# EAGLE design fonte3 (EAGLE 9.6.2)
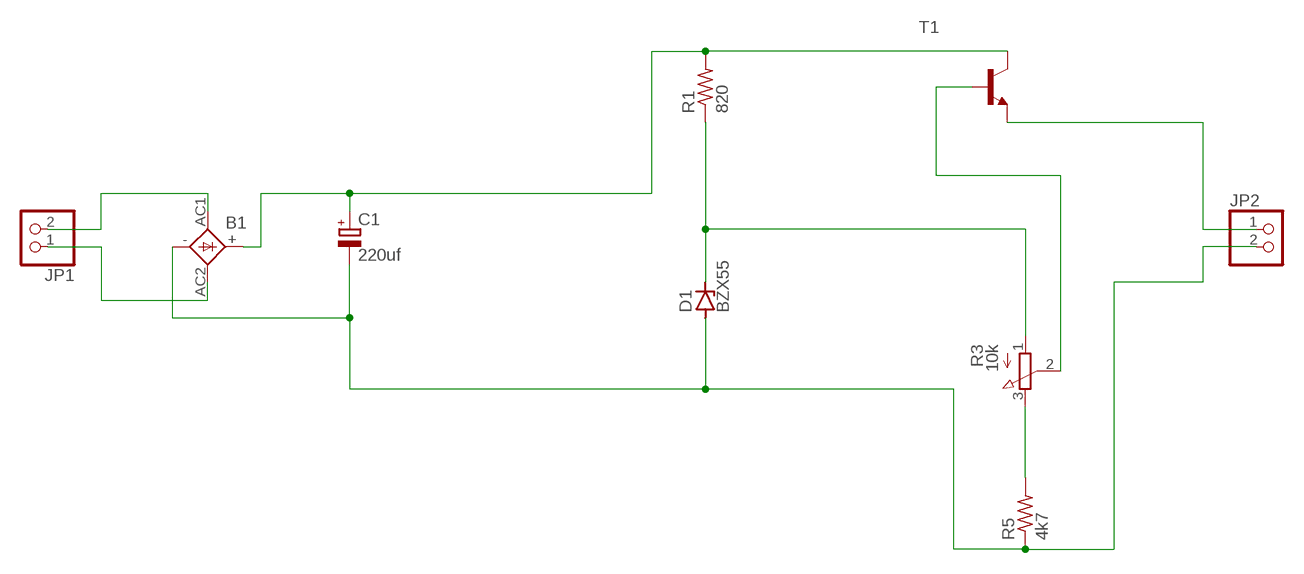
[diagram p0: schematic, sheet 1]

## Parts
B1  1KAB  [1KAB]
C1  220uf  CPOL-EUE5-10.5  [E5-10,5]
D1  BZX55  [DO35Z10]
JP1  PINHD-1X2  [1X02]
JP2  PINHD-1X2  [1X02]
R1  820  R-US_0309/12  [0309/12]
R3  10k  3RP/1610N  [3RP/1610N]
R5  4k7  R-US_0309/12  [0309/12]
T1  -NPN-TO5  [TO5]

## Nets
N$1: B1.AC1 JP1.2
N$2: B1.AC2 JP1.1
N$3: B1.+ C1.+ R1.2 T1.3(C)
N$4: R3.3(E) R5.2
N$5: B1.- C1.- D1.A JP2.2 R5.1
N$6: JP2.1 T1.1(E)
N$7: R3.2(S) T1.2(B)
N$9: D1.C R1.1 R3.1(A)

## Library data of the parts
B1 = rectifier:1KAB: RECTIFIER grid 5,08 x 5,08 mm
C1 = resistor:CPOL-EU: POLARIZED CAPACITOR, European symbol
D1 = diode:BZX55: Z DIODE
JP1 JP2 = pinhead:PINHD-1X2: PIN HEADER
R1 R5 = rcl:R-US_: RESISTOR, American symbol; SPICEPREFIX: R
R3 = pot:3RP/1610N: 16mm Potentiometer one level Source: http://www.alphapotentiometers.net/html/16mm_pot_2.html
T1 = transistor:*-NPN-: NPN Transistror BF959 corrected 2008.03.06

## Board
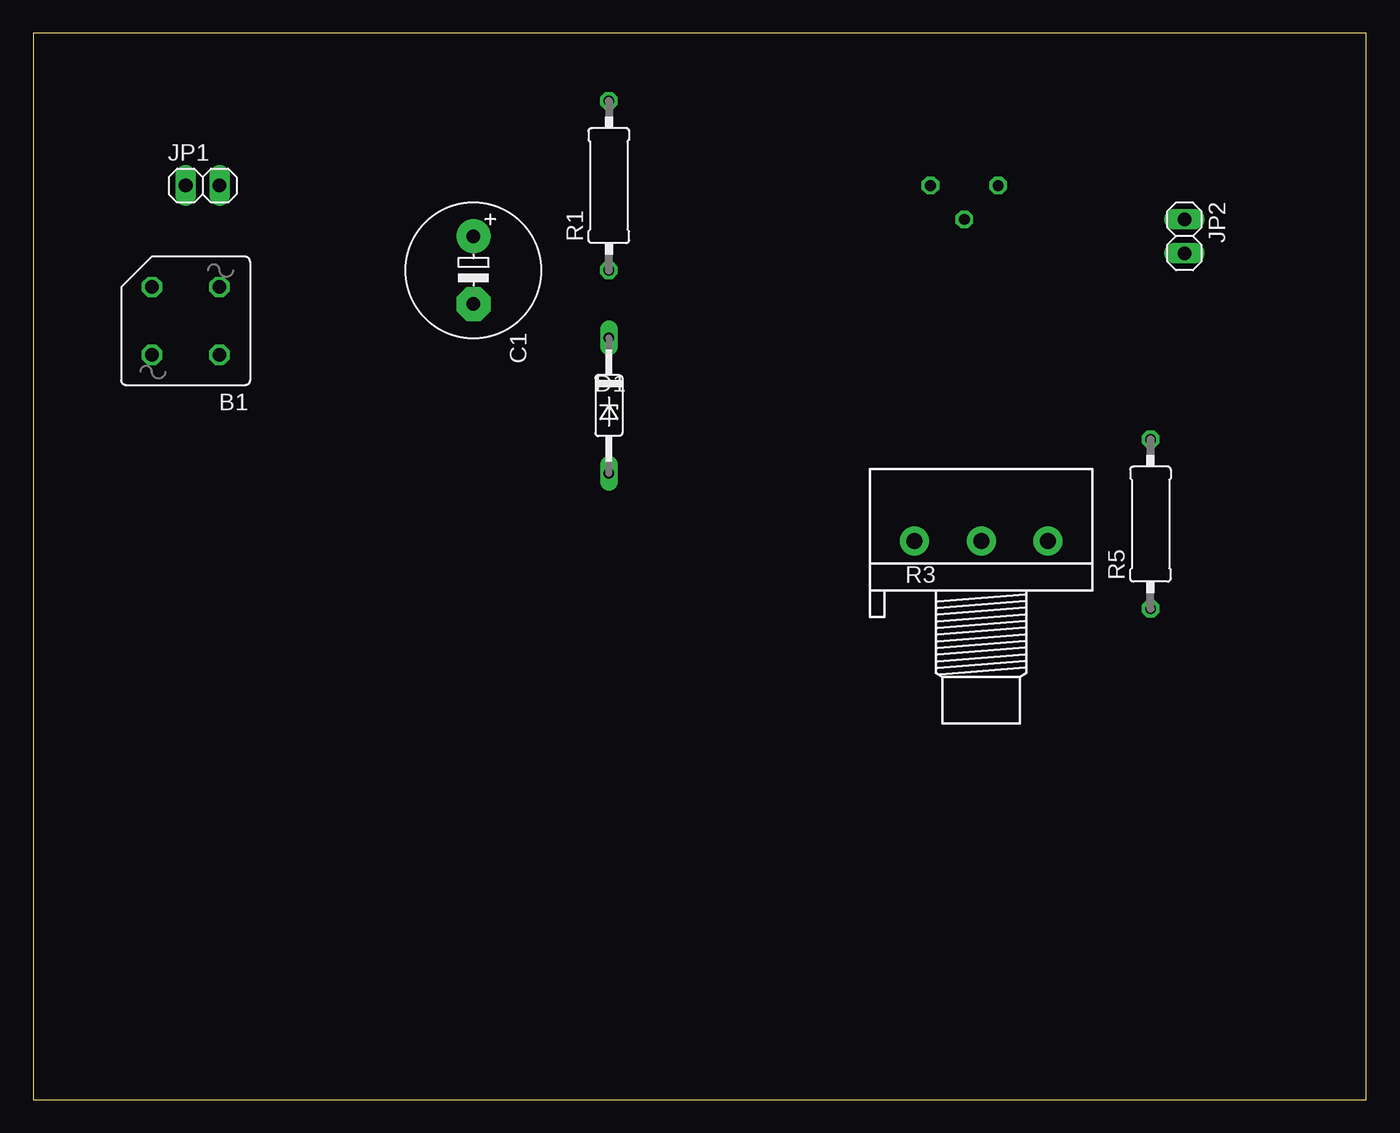
[diagram p1: board, top side]
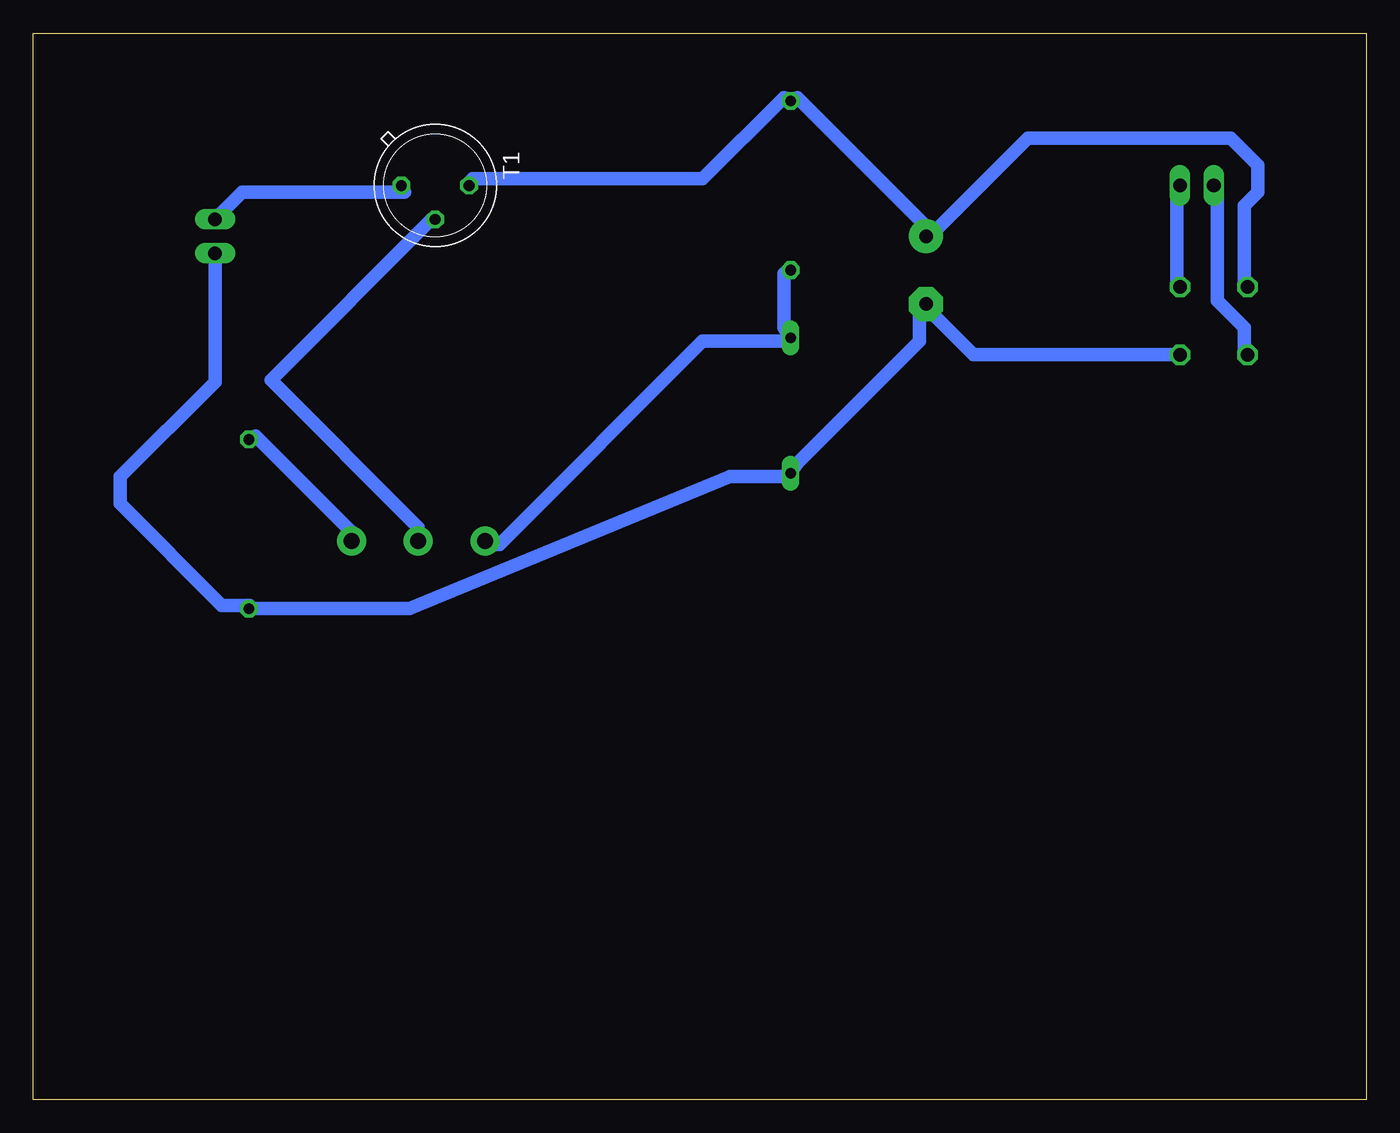
[diagram p2: board, bottom side, seen from below]

Size 100 x 80 mm. Coordinates in mm from the lower left corner, seen from the top.
Outline: 0,0 100,0 100,80 0,80 0,0
Copper layers (1*16): Top 0.035mm / dielectric 1.5mm / Bottom 0.035mm
Design rules "default *": minimum track width 40mil, minimum drill 0.35mm, track to track 40mil, track to pad 40mil, pad to pad 6mil, via to via 6mil, smd to smd 6mil, copper to edge 40mil, drill to drill 6mil, minimum pad ring 10mil, minimum via ring 8mil, stop-mask expansion 4mil, vias tented up to drill 0mil, thermal gap 10mil

### Footprints (pad centres in the part's own frame; a part is rotated, then mirrored left to right if it is on the bottom)
1KAB = drill 1.016 octagon: + 2.54,-2.54; - -2.54,2.54; AC1 -2.54,-2.54; AC2 2.54,2.54
E5-10,5 = drill 1.016 pad 2.54: + -2.54,0 | drill 1.016 pad 2.54 octagon: - 2.54,0
DO35Z10 = drill 0.813 long: A 5.08,0; C -5.08,0
1X02 = drill 1.016 long: 1 -1.27,0; 2 1.27,0
0309/12 = drill 0.813 octagon: 1 -6.35,0; 2 6.35,0
3RP/1610N = drill 1.2 pad 2.184: 1 -5,0; 2 0,0; 3 5,0
TO5 = drill 0.813 octagon: 1 0,-2.54; 2 2.54,0; 3 0,2.54

### Placement (x,y rotation side)
B1  11.43,58.42 180 top
C1  33.02,62.23 270 top
D1  43.18,52.07 270 top
JP1  12.7,68.58 0 top
JP2  86.36,64.77 270 top
R1  43.18,68.58 90 top
R3  71.12,41.91 0 top
R5  83.82,43.18 90 top
T1  69.85,68.58 270 bottom

### Tracks (layer width: path | path; a pad name or v marks a point on that pad's centre or on a via)
N$1
  Bottom 1.016: B1.AC1 14.22,60.96 14.22,68.07 JP1.2
N$2
  Bottom 1.016: B1.AC2 9.14,55.88 9.14,57.91 11.18,59.94 11.18,68.07 JP1.1
N$3
  Bottom 1.016: 32.51,65.02 42.67,75.18 R1.2 43.69,75.18 49.78,69.09 67.06,69.09 T1.3 | 32.51,65.02 25.4,72.14 10.16,72.14 8.13,70.1 8.13,68.07 9.14,67.06 9.14,60.96 B1.+ | 32.51,65.02 C1.+
N$4
  Bottom 1.016: R5.2 83.31,49.78 76.2,42.67 R3.3
N$5
  Bottom 1.016: B1.- 29.46,55.88 32.51,58.93 C1.- 33.53,58.93 33.53,56.9 42.67,47.75 D1.A 43.69,46.74 47.71,46.74 71.79,36.83 R5.1 83.76,37.08 85.85,37.08 93.47,44.7 93.47,46.74 86.36,53.85 JP2.2
N$6
  Bottom 1.016: JP2.1 84.33,68.07 72.14,68.07 T1.1
N$7
  Bottom 1.016: T1.2 70.1,66.04 82.17,53.98 71.12,42.93 R3.2
N$9
  Bottom 1.016: R1.1 43.69,61.98 43.69,57.91 D1.C 43.69,56.9 49.78,56.9 65.02,41.66 66.12,41.66 R3.1